# Altium schematic sheet Ciruit_Analyzer.SchDoc
size A4; Organization: Altium Limited; Address1: L3, 12a Rodborough Rd; Address2: Frenchs Forest; Address3: NSW; Address4: Australia 2086
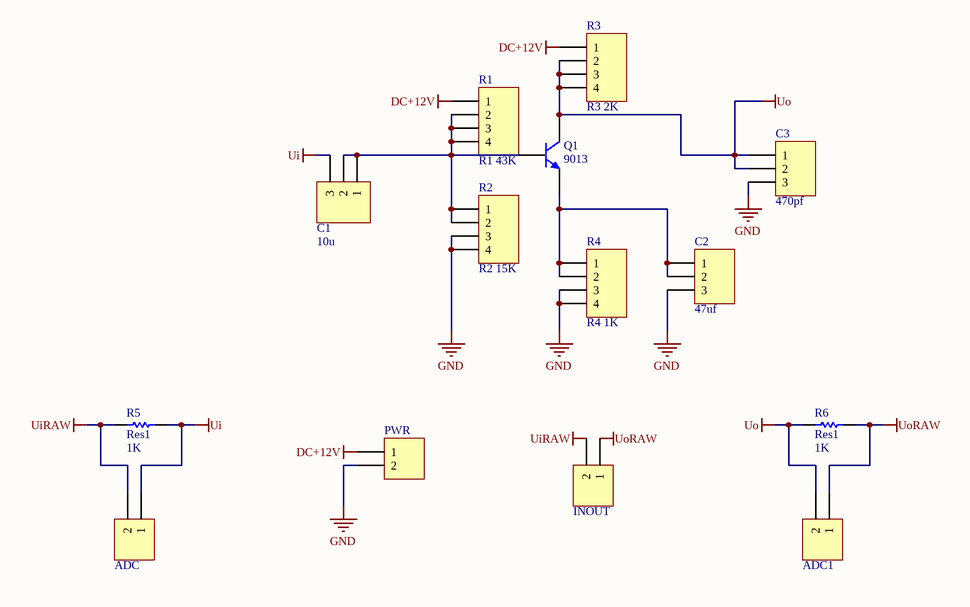
[diagram p0: Ciruit_Analyzer.SchDoc]

## Parts
ADC  (no value)  [HDR1X2]
ADC1  (no value)  [HDR1X2]
C1  10u  [HDR1X3]
C2  47uf  [HDR1X3]
C3  470pf  [HDR1X3]
INOUT  (no value)  [HDR1X2]
PWR  (no value)  [HDR1X2]
Q1  9013  [TO-92A]
R1  R1 43K  [HDR1X4]
R2  R2 15K  [HDR1X4]
R3  R3 2K  [HDR1X4]
R4  R4 1K  [HDR1X4]
R5  Res1  value 1K  [6-0805_M]
R6  Res1  value 1K  [6-0805_M]

## Nets
DC+12V: PWR.1 R1.1 R3.1
GND: C2.3 C3.3 PWR.2 R2.3 R2.4 R4.3 R4.4
Ui: ADC.1 C1.3 R5.2
UiRAW: ADC.2 INOUT.2 R5.1
Uo: ADC1.2 C3.1 C3.2 Q1.3(C) R3.2 R3.3 R3.4 R6.1
UoRAW: ADC1.1 INOUT.1 R6.2
NetC1_1: C1.1 C1.2 Q1.2(B) R1.2 R1.3 R1.4 R2.1 R2.2
NetC2_1: C2.1 C2.2 Q1.1(E) R4.1 R4.2

## Notes on the sheet
- Title
- Size:
- Date:
- A4
- Number:
- Time:
- Revision:
- Sheet
- of
- File:

## Library data of the parts
ADC ADC1 INOUT PWR = Header 2: Header, 2-Pin; LatestRevisionDate: 17-Jul-2002; LatestRevisionNote: Re-released for DXP Platform.; Publisher: Altium Limited
C1-C3 = Header 3: Header, 3-Pin; LatestRevisionDate: 17-Jul-2002; LatestRevisionNote: Re-released for DXP Platform.; Publisher: Altium Limited
Q1 = 2N3904: NPN General Purpose Amplifier; Published: 8-Jun-2000; LatestRevisionDate: 15-Jan-2003; LatestRevisionNote: PCB Footprint 'BCY-W3/D4.7' replaced; DatasheetVersion: 1997; PackageVersion: Sep-1998; PackageReference: TO-92A; Publisher: Altium Limited; PackageDescription: TO, Flat Index; 3 In-Line, Axial Leads; Body Dia. 4.5mm; Leads 0.51 x 0.48 mm (max); ComponentLink1Description: Manufacturer Link; ComponentLink1URL: http://www.fairchildsemi.com/; ComponentLink2Description: Datasheet; ComponentLink2URL: http://www.fairchildsemi.com/ds/2N%2F2N3904.pdf
R1-R4 = Header 4: Header, 4-Pin; LatestRevisionDate: 17-Jul-2002; LatestRevisionNote: Re-released for DXP Platform.; Publisher: Altium Limited
R5 R6 = Res1: Resistor; Published: 8-Jun-2000; LatestRevisionDate: 17-Jul-2002; LatestRevisionNote: Re-released for DXP Platform.; PackageReference: AXIAL-0.3; Publisher: Altium Limited; PackageDescription: Axial Device, Thru-Hole; 2 Leads; 0.3 in Pin Spacing